# EAGLE design untitled (EAGLE 7.4.0)
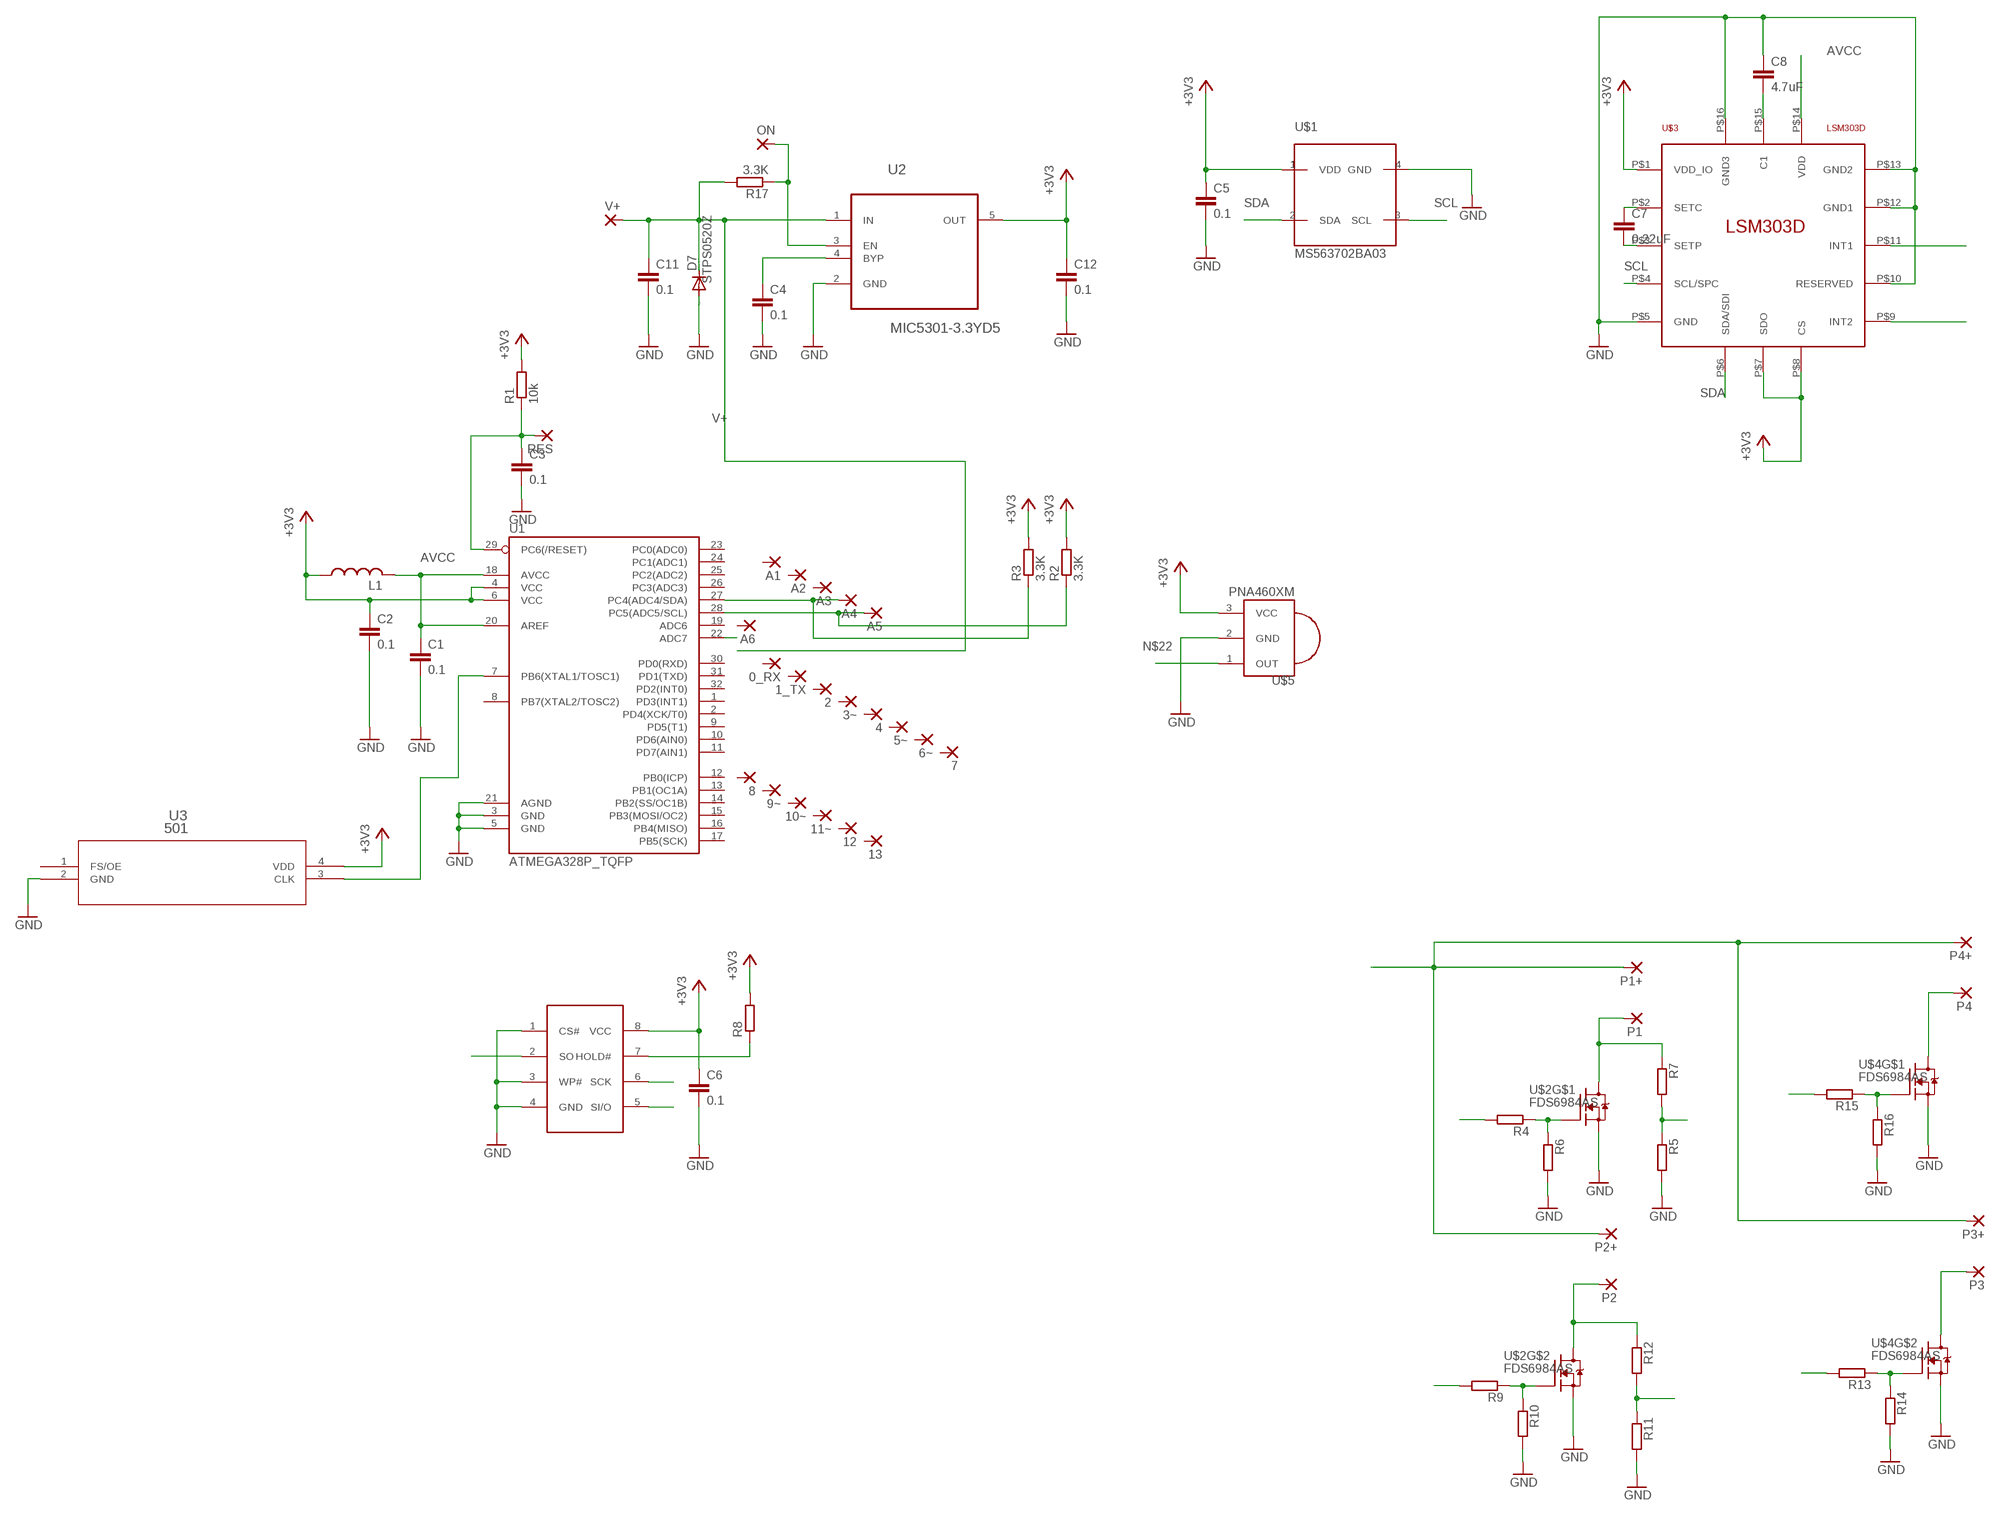
[diagram p0: schematic, sheet 1]

## Parts
0_RX  WIREPAD1,6/0,8  [1,6/0,8]
1_TX  WIREPAD1,6/0,8  [1,6/0,8]
2  WIREPAD1,6/0,8  [1,6/0,8]
3~  WIREPAD1,6/0,8  [1,6/0,8]
4  WIREPAD1,6/0,8  [1,6/0,8]
5~  WIREPAD1,6/0,8  [1,6/0,8]
6~  WIREPAD1,6/0,8  [1,6/0,8]
7  WIREPAD1,6/0,8  [1,6/0,8]
8  WIREPAD1,6/0,8  [1,6/0,8]
9~  WIREPAD1,6/0,8  [1,6/0,8]
10~  WIREPAD1,6/0,8  [1,6/0,8]
11~  WIREPAD1,6/0,8  [1,6/0,8]
12  WIREPAD1,6/0,8  [1,6/0,8]
13  WIREPAD1,6/0,8  [1,6/0,8]
A1  WIREPAD1,6/0,8  [1,6/0,8]
A2  WIREPAD1,6/0,8  [1,6/0,8]
A3  WIREPAD1,6/0,8  [1,6/0,8]
A4  WIREPAD1,6/0,8  [1,6/0,8]
A5  WIREPAD1,6/0,8  [1,6/0,8]
A6  WIREPAD1,6/0,8  [1,6/0,8]
C1  0.1  C-EUC0805  [C0805]
C2  0.1  C-EUC0805  [C0805]
C3  0.1  C-EUC0805  [C0805]
C4  0.1  C-EUC0805  [C0805]
C5  0.1  C-EUC0805  [C0805]
C6  0.1  C-EUC0805  [C0805]
C7  0.22uF  C-EUC0603  [C0603]
C8  4.7uF  C-EUC0603  [C0603]
C11  0.1  C-EUC0805  [C0805]
C12  0.1  C-EUC0805  [C0805]
D7  CGRM4001-G  [SOD-123_MINI-SMA]
L1  L-USL2012C  [L2012C]
ON  WIREPAD1,6/0,8  [1,6/0,8]
P1  WIREPAD1,6/0,8  [1,6/0,8]
P1+  WIREPAD1,6/0,8  [1,6/0,8]
P2  WIREPAD1,6/0,8  [1,6/0,8]
P2+  WIREPAD1,6/0,8  [1,6/0,8]
P3  WIREPAD1,6/0,8  [1,6/0,8]
P3+  WIREPAD1,6/0,8  [1,6/0,8]
P4  WIREPAD1,6/0,8  [1,6/0,8]
P4+  WIREPAD1,6/0,8  [1,6/0,8]
R1  10k  R-EU_R0805  [R0805]
R2  3.3K  R-EU_R0805  [R0805]
R3  3.3K  R-EU_R0805  [R0805]
R4  R-EU_R0805  [R0805]
R5  R-EU_R0805  [R0805]
R6  R-EU_R0805  [R0805]
R7  R-EU_R0805  [R0805]
R8  R-EU_R0805  [R0805]
R9  R-EU_R0805  [R0805]
R10  R-EU_R0805  [R0805]
R11  R-EU_R0805  [R0805]
R12  R-EU_R0805  [R0805]
R13  R-EU_R0805  [R0805]
R14  R-EU_R0805  [R0805]
R15  R-EU_R0805  [R0805]
R16  R-EU_R0805  [R0805]
R17  3.3K  R-EU_R0805  [R0805]
RES  WIREPAD1,6/0,8  [1,6/0,8]
U1  ATMEGA328P_TQFP  [TQFP32-08]
U2  MIC5301-3.3YD5  MIC5205-3.3YM5TR  [SOT95P280X130-5N]
U3  501  [SI501_4_2X2.5]
U$1  MS563702BA03  [MS5637]
U$2  FDS6984AS  [SO8]
U$3  LSM303D  [TFLGA16L]
U$4  FDS6984AS  [SO8]
U$5  PNA460XM  [PNA460XM]
U$6  25FL208K0RMFI041  [SO08]
V+  WIREPAD1,6/0,8  [1,6/0,8]

## Nets
10: R8.1 U$6.7(HOLD#)
+3V3: C2.1 C5.1 C6.1 C12.1 L1.1 R1.2 R2.2 R3.2 R8.2 U1.4(VCC) U1.6(VCC) U2.5(OUT) U3.4(VDD) U$1.1(VDD) U$3.P$1(VDD_IO) U$3.P$7(SDO) U$3.P$8(CS) U$5.3(VCC) U$6.8(VCC)
AVCC: C1.1 L1.2 U1.18(AVCC) U1.20(AREF) U$3.P$14(VDD)
GND: C1.2 C2.2 C3.2 C4.2 C5.2 C6.2 C8.1 C11.2 C12.2 D7.A R5.2 R6.2 R10.2 R11.2 R14.2 R16.2 U1.3(GND) U1.5(GND) U1.21(AGND) U2.2(GND) U3.2(GND) U$1.4(GND) U$2.1(S) U$2.3(S) U$3.P$5(GND) U$3.P$10(RESERVED) U$3.P$12(GND1) U$3.P$13(GND2) U$3.P$16(GND3) U$4.1(S) U$4.3(S) U$5.2(GND) U$6.1(CS#) U$6.3(WP#) U$6.4(GND)
GYROINT1: U$3.P$11(INT1)
GYROINT2: U$3.P$9(INT2)
MISO: U$6.2(SO)
MOSI: U$6.5(SI/O)
N$1: U1.22(ADC7)
N$10: U1.7(PB6(XTAL1/TOSC1)) U3.3(CLK)
N$13: R4.1 R6.1 U$2.4(G)
N$18: P1.1(P) R7.1 U$2.5(D) U$2.6(D)
N$19: R11.1 R12.2
N$21: C7.1 U$3.P$2(SETC)
N$22: U$5.1(OUT)
N$24: R5.1 R7.2
N$25: C7.2 U$3.P$3(SETP)
N$26: C3.1 R1.1 RES.1(P) U1.29(PC6(/RESET))
N$27: C8.2 U$3.P$15(C1)
N$28: R4.2
N$29: R9.1 R10.1 U$2.2(G)
N$30: P2.1(P) R12.1 U$2.7(D) U$2.8(D)
N$31: C4.1 U2.4(BYP)
N$32: R9.2
N$33: R13.1 R14.1 U$4.2(G)
N$34: P3.1(P) U$4.7(D) U$4.8(D)
N$35: R13.2
N$36: ON.1(P) R17.1 U2.3(EN)
N$41: R15.1 R16.1 U$4.4(G)
N$42: P4.1(P) U$4.5(D) U$4.6(D)
N$43: R15.2
N$44: P1+.1(P) P2+.1(P) P3+.1(P) P4+.1(P)
SCK: U$6.6(SCK)
SCL: A5.1(P) R2.1 U1.28(PC5(ADC5/SCL)) U$1.3(SCL) U$3.P$4(SCL/SPC)
SDA: A4.1(P) R3.1 U1.27(PC4(ADC4/SDA)) U$1.2(SDA) U$3.P$6(SDA/SDI)
V+: C11.1 D7.C R17.2 U2.1(IN) V+.1(P)
Unconnected: 0_RX.1(P) 1_TX.1(P) 2.1(P) 3~.1(P) 4.1(P) 5~.1(P) 6~.1(P) 7.1(P) 8.1(P) 9~.1(P) 10~.1(P) 11~.1(P) 12.1(P) 13.1(P) A1.1(P) A2.1(P) A3.1(P) A6.1(P) U1.1(PD3(INT1)) U1.2(PD4(XCK/T0)) U1.8(PB7(XTAL2/TOSC2)) U1.9(PD5(T1)) U1.10(PD6(AIN0)) U1.11(PD7(AIN1)) U1.12(PB0(ICP)) U1.13(PB1(OC1A)) U1.14(PB2(SS/OC1B)) U1.15(PB3(MOSI/OC2)) U1.16(PB4(MISO)) U1.17(PB5(SCK)) U1.19(ADC6) U1.23(PC0(ADC0)) U1.24(PC1(ADC1)) U1.25(PC2(ADC2)) U1.26(PC3(ADC3)) U1.30(PD0(RXD)) U1.31(PD1(TXD)) U1.32(PD2(INT0)) U3.1(FS/OE)

## Library data of the parts
0_RX 1_TX 2 3~ 4 5~ 6~ 7 8 9~ 10~ 11~ 12 13 A1-A6 ON P1 P1+ P2 P2+ P3 P3+ P4 P4+ RES V+ = wirepad:WIREPAD: Wire PAD connect wire on PCB
C1-C6 C11 C12 = resistor:C-EU: CAPACITOR, European symbol
C7 C8 = rcl:C-EU: CAPACITOR, European symbol
D7 = diode:CGRM400*-G: Molded plasitc,JEDEC SOD-123/Mini SMA Source: Comchip CGRM4001-G.pdf; FARNELL: 1467545; LINK: http://lv.farnell.com/stmicroelectronics/stps0520z/diode-schottky-2a-20v-smd/dp/1467545; MFGNAME: STPS0520Z
L1 = resistor:L-US: INDUCTOR, American symbol
R1-R17 = resistor:R-EU_: RESISTOR, European symbol
U1 = SparkFun-DigitalIC:ATMEGA328P_TQFP; PROD_ID: IC-09069
U2 = Micrel_By_element14_Batch_1:MIC5205-3.3YM5TR: 150mA Low-Noise LDO Regulator; MPN: MIC5301-3.3YD5; OC_FARNELL: 2431779; PACKAGE: SOT-23-5; SUPPLIER: MICREL SEMICONDUCTOR; URL: http://lv.farnell.com/micrel-semiconductor/mic5301-3-3yd5-tr/ldo-volt-reg-0-15a-3-3v-tsot-23/dp/2431779
U3 = SiLabs2025:501; MANUFACTURER_PART_NUMBER: 501; VENDOR: SILICONLABS
U$1 = freetronics-original:MS5637
U$2 U$4 = FDS6984AS:FDS6984AS; FARNELL: 2454158; MFG: FDS6984AS; URL: http://lv.farnell.com/fairchild-semiconductor/fds6984as/mosfet-dual-n-ch-30v-8-5a-soic/dp/2454158
U$3 = LSM303D:LSM303D
U$5 = adafruit:PNA460XM: IR 38KHz receiver PNA4602 and related receivers http://www.ladyada.net/library/pcb/eaglelibrary.html
U$6 = MEMORY-8PIN:25FL208K0RMFI041

## Board
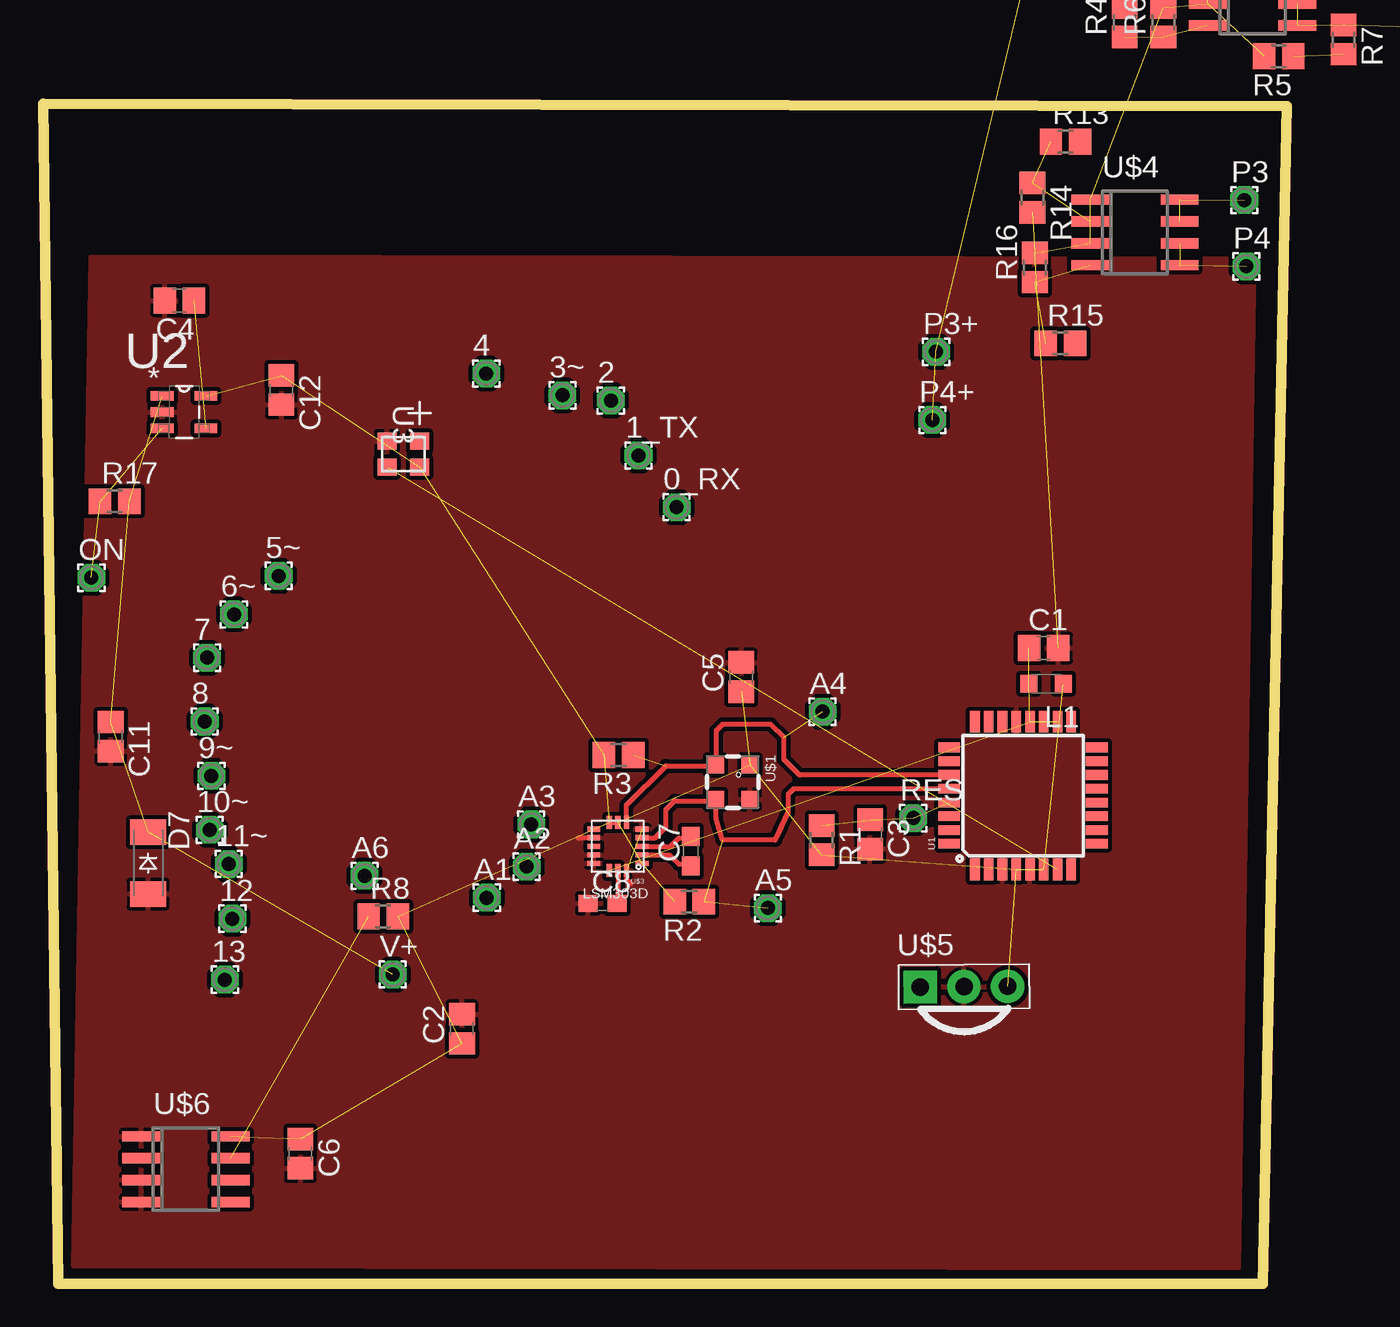
[diagram p1: board, top side]

Size 72.29 x 68.58 mm. Coordinates in mm from the lower left corner, seen from the top.
Outline: 0.89,0 70.89,0 72.29,68.45 0,68.58 0.89,0
Copper layers (1*16): Top 0.018mm / dielectric 1.55mm / Bottom 0.018mm
Design rules "eC_2Layer_PClass6_BaseCopperO18_eCDefault": minimum track width 0.15mm, minimum drill 0.35mm, track to track 0.15mm, track to pad 0.15mm, pad to pad 0.15mm, via to via 0.15mm, smd to smd 0mil, copper to edge 0.25mm, drill to drill 0.35mm, minimum pad ring 0.175mm, minimum via ring 0.125mm, stop-mask expansion 0mil, vias tented up to drill 0.45mm, thermal gap 0.2mm

### Footprints (pad centres in the part's own frame; a part is rotated, then mirrored left to right if it is on the bottom)
1,6/0,8 = drill 0.813 pad 1.6 octagon: 1 0,0
C0805 = smd 1.3 x 1.5: 1 -0.85,0; 2 0.85,0
C0603 = smd 1.1 x 1: 1 -0.85,0; 2 0.85,0
SOD-123_MINI-SMA = smd 1.5 x 2.1: A 1.8,0; C -1.8,0
L2012C = smd 1 x 1: 1 -1,0; 2 1,0
R0805 = smd 1.3 x 1.5: 1 -0.85,0; 2 0.85,0
TQFP32-08 = smd 1.27 x 0.559: 1 -4.293,2.8; 2 -4.293,2; 3 -4.293,1.2; 4 -4.293,0.4; 5 -4.293,-0.4; 6 -4.293,-1.2; 7 -4.293,-2; 8 -4.293,-2.8; 17 4.293,-2.8; 18 4.293,-2; 19 4.293,-1.2; 20 4.293,-0.4; 21 4.293,0.4; 22 4.293,1.2; 23 4.293,2; 24 4.293,2.8 | smd 0.559 x 1.27: 9 -2.8,-4.293; 10 -2,-4.293; 11 -1.2,-4.293; 12 -0.4,-4.293; 13 0.4,-4.293; 14 1.2,-4.293; 15 2,-4.293; 16 2.8,-4.293; 25 2.8,4.293; 26 2,4.293; 27 1.2,4.293; 28 0.4,4.293; 29 -0.4,4.293; 30 -1.2,4.293; 31 -2,4.293; 32 -2.8,4.293
SOT95P280X130-5N = smd 1.321 x 0.559: 1 -1.27,0.94; 2 -1.27,0; 3 -1.27,-0.94; 4 1.27,-0.94; 5 1.27,0.94
SI501_4_2X2.5 = smd 1 x 1.1: 1 -0.75,0.95; 2 -0.75,-0.95; 3 0.75,-0.95; 4 0.75,0.95
MS5637 = smd 1 x 1: 1 -1,1; 2 -1,-1; 3 1,-1; 4 1,1
SO8 = smd 0.6 x 2.2: 1 -1.905,-2.6; 2 -0.635,-2.6; 3 0.635,-2.6; 4 1.905,-2.6; 5 1.905,2.6; 6 0.635,2.6; 7 -0.635,2.6; 8 -1.905,2.6
TFLGA16L = smd 0.75 x 0.3: P$1 -1.4,1; P$2 -1.4,0.5; P$3 -1.4,0; P$4 -1.4,-0.5; P$5 -1.4,-1; P$9 1.4,-1; P$10 1.4,-0.5; P$11 1.4,0; P$12 1.4,0.5; P$13 1.4,1 | smd 0.3 x 0.75: P$6 -0.5,-1.4; P$7 0,-1.4; P$8 0.5,-1.4; P$14 0.5,1.4; P$15 0,1.4; P$16 -0.5,1.4
PNA460XM = drill 1.016 pad 1.93 square: 1 -2.54,0 | drill 1.016 pad 1.93: 2 0,0; 3 2.54,0
SO08 = smd 0.6 x 2.2: 1 -1.905,-2.6; 2 -0.635,-2.6; 3 0.635,-2.6; 4 1.905,-2.6; 5 1.905,2.6; 6 0.635,2.6; 7 -0.635,2.6; 8 -1.905,2.6

### Placement (x,y rotation side)
0_RX  36.82,45.13 0 top
1_TX  34.61,48.14 0 top
2  33,51.33 0 top
3~  30.19,51.64 0 top
4  25.76,52.9 0 top
5~  13.7,41.14 0 top
6~  11.1,38.9 0 top
7  9.54,36.39 0 top
8  9.4,32.68 0 top
9~  9.78,29.51 0 top
10~  9.69,26.38 0 top
11~  10.79,24.39 0 top
12  11.01,21.21 0 top
13  10.57,17.67 0 top
A1  25.79,22.43 0 top
A2  28.11,24.24 0 top
A3  28.37,26.69 0 top
A4  45.31,33.25 0 top
A5  42.13,21.83 0 top
A6  18.69,23.71 0 top
C1  58.16,36.95 0 top
C2  24.35,14.82 90 top
C3  48.07,26.11 270 top
C4  7.93,57.14 180 top
C5  40.58,35.26 90 top
C6  14.96,7.56 270 top
C7  37.65,25.14 90 top
C8  32.52,22.11 0 top
C11  3.93,31.8 270 top
C12  13.85,51.94 270 top
D7  6.11,24.44 270 top
L1  58.3,34.86 180 top
ON  2.81,41.03 0 top
P1  80.79,73.02 0 top  (outside the outline)
P1+  57.12,76.06 0 top  (outside the outline)
P2  81.07,75.94 0 top  (outside the outline)
P2+  57.5,80.91 0 top  (outside the outline)
P3  69.82,62.98 0 top
P3+  51.91,54.16 0 top
P4  69.94,59.13 0 top
P4+  51.69,50.2 0 top
R1  45.25,25.78 270 top
R2  37.56,22.21 180 top
R3  33.45,30.73 180 top
R4  62.86,73.31 90 top  (outside the outline)
R5  71.82,71.34 180 top
R6  65.11,73.32 90 top  (outside the outline)
R7  75.59,72.31 270 top  (outside the outline)
R8  19.77,21.34 0 top
R9  62.9,77.38 90 top  (outside the outline)
R10  65.13,77.37 90 top  (outside the outline)
R11  71.75,78.84 180 top  (outside the outline)
R12  75.7,77.9 90 top  (outside the outline)
R13  59.43,66.37 0 top
R14  57.51,63.12 270 top
R15  59.13,54.65 0 top
R16  57.65,59.06 90 top
R17  4.17,45.47 0 top
RES  50.57,27.06 0 top
U1  56.96,28.37 90 top
U2  8.2,50.66 0 top
U3  20.94,48.22 270 top
U$1  40.09,29.15 270 top
U$2  70.3,75.04 270 top  (outside the outline)
U$3  33.41,25.42 180 top
U$4  63.46,61.1 270 top
U$5  53.53,17.26 0.5 top
U$6  8.31,6.66 270 top
V+  20.32,17.97 0 top

### Tracks (layer width: path | path; a pad name or v marks a point on that pad's centre or on a via)
10  (1 unrouted)
+3V3  (17 unrouted)
  Top 0.305: U$3.P$8 U$3.P$7
AVCC  (4 unrouted)
GND  (11 unrouted)
  Top 0.305: U$3.P$16 33.91,23.5 34.16,23.24 | U$3.P$10 31.13,25.92 31.11,25.91
  pour Top (isolate 0.254): 2.79,59.69 70.36,59.56 69.47,0.89 1.78,1.02
N$10  (1 unrouted)
N$13  (2 unrouted)
N$18  (3 unrouted)
N$19  (1 unrouted)
N$21
  Top 0.305: U$3.P$2 36.42,24.92 36.96,24.38 37.56,24.38 C7.1
N$24  (1 unrouted)
N$25
  Top 0.305: U$3.P$3 36.47,25.42 36.96,25.91 37.57,25.91 C7.2
N$26  (3 unrouted)
N$27
  Top 0.305: U$3.P$15 33.41,22.14 C8.2
N$29  (2 unrouted)
N$30  (3 unrouted)
N$31  (1 unrouted)
N$33  (2 unrouted)
N$34  (2 unrouted)
N$36  (2 unrouted)
N$41  (2 unrouted)
N$42  (2 unrouted)
N$44  (3 unrouted)
SCL  (2 unrouted)
  Top 0.305: U1.28 43.63,28.77 43.31,28.45 43.31,27.43 42.55,25.78 39.5,25.78 39.12,27.05 39.12,28.13 U$1.3 39.01,28.07 36.7,28.07 36.2,27.56 36.2,26.54 35.57,25.92 U$3.P$4
SDA  (2 unrouted)
  Top 0.305: U1.27 43.97,29.57 43.05,30.48 43.05,31.75 42.29,32.51 39.5,32.51 39.12,32.13 39.12,30.18 U$1.2 39.04,30.1 36.2,30.1 33.91,27.81 U$3.P$6
V+  (4 unrouted)